# Altium schematic sheet STM321.SchDoc
size A4
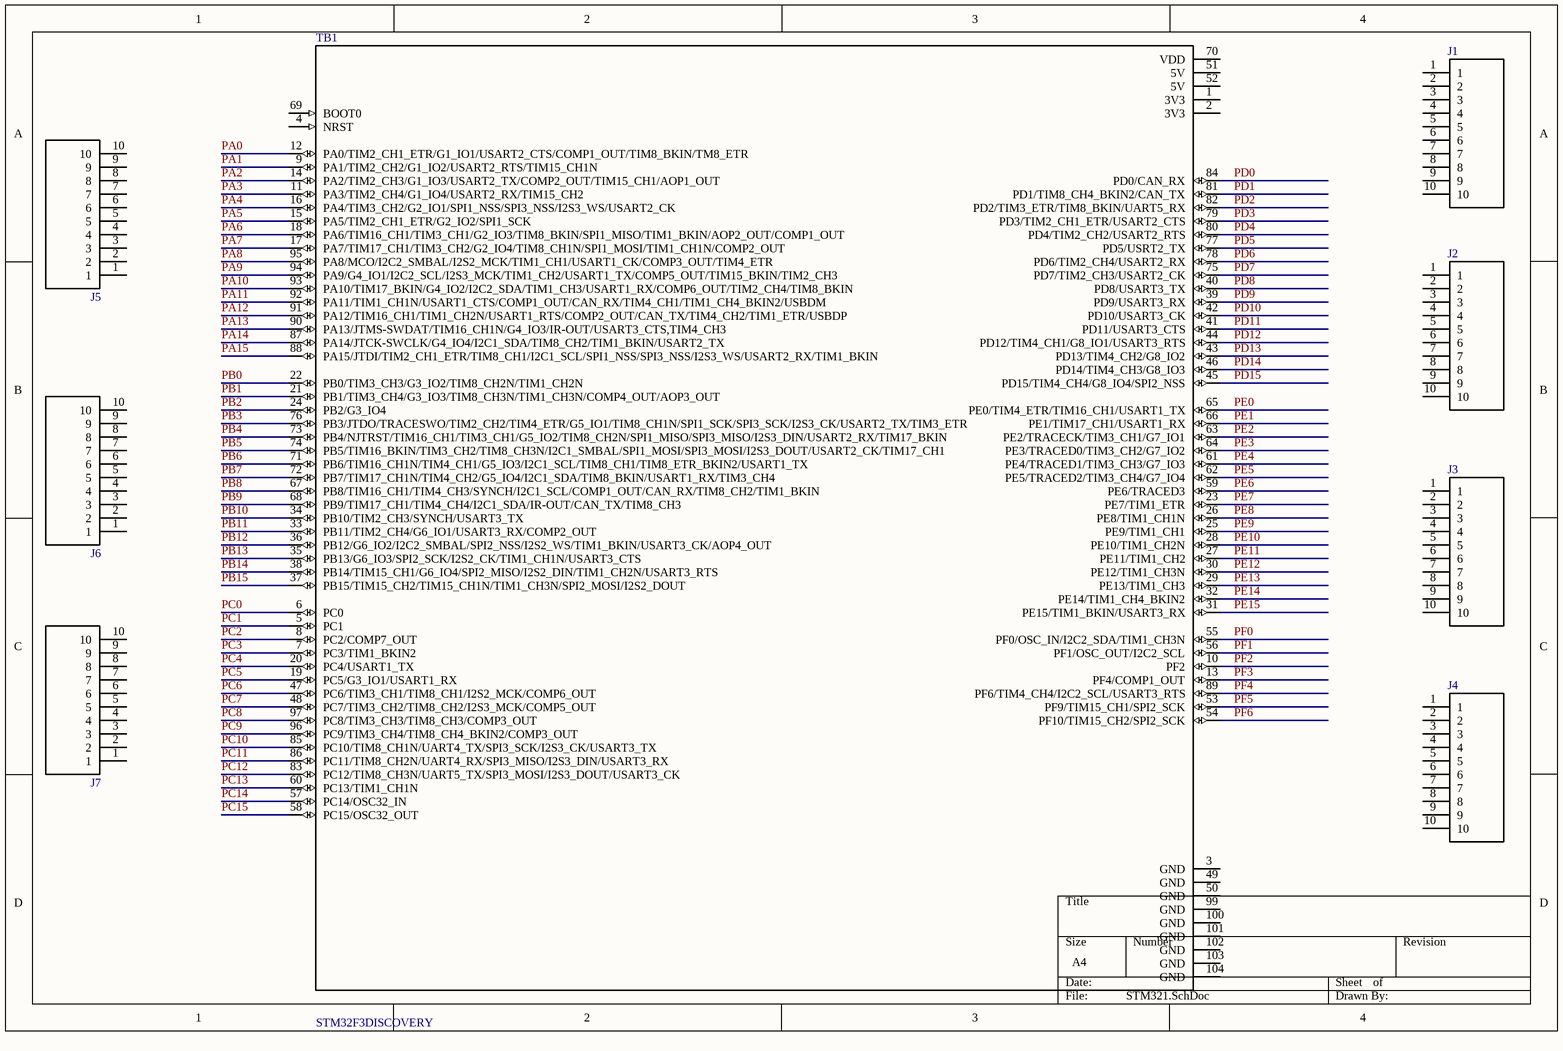
[diagram p0: STM321.SchDoc]

## Parts
J1  2-1761603-3  [*TE_2-1761603-3]  (value not drawn)
J2  2-1761603-3  [*TE_2-1761603-3]  (value not drawn)
J3  2-1761603-3  [*TE_2-1761603-3]  (value not drawn)
J4  2-1761603-3  [*TE_2-1761603-3]  (value not drawn)
J5  2-1761603-3  [*TE_2-1761603-3]  (value not drawn)
J6  2-1761603-3  [*TE_2-1761603-3]  (value not drawn)
J7  2-1761603-3  [*TE_2-1761603-3]  (value not drawn)
TB1  STM32F3DISCOVERY  [*SHIELD_STM32F3DISCOVERY]

## Nets
PA0: TB1.12(PA0/TIM2_CH1_ETR/G1_IO1/USART2_CTS/COMP1_OUT/TIM8_BKIN/TM8_ETR)
PA1: TB1.9(PA1/TIM2_CH2/G1_IO2/USART2_RTS/TIM15_CH1N)
PA2: TB1.14(PA2/TIM2_CH3/G1_IO3/USART2_TX/COMP2_OUT/TIM15_CH1/AOP1_OUT)
PA3: TB1.11(PA3/TIM2_CH4/G1_IO4/USART2_RX/TIM15_CH2)
PA4: TB1.16(PA4/TIM3_CH2/G2_IO1/SPI1_NSS/SPI3_NSS/I2S3_WS/USART2_CK)
PA5: TB1.15(PA5/TIM2_CH1_ETR/G2_IO2/SPI1_SCK)
PA6: TB1.18(PA6/TIM16_CH1/TIM3_CH1/G2_IO3/TIM8_BKIN/SPI1_MISO/TIM1_BKIN/AOP2_OUT/COMP1_OUT)
PA7: TB1.17(PA7/TIM17_CH1/TIM3_CH2/G2_IO4/TIM8_CH1N/SPI1_MOSI/TIM1_CH1N/COMP2_OUT)
PA8: TB1.95(PA8/MCO/I2C2_SMBAL/I2S2_MCK/TIM1_CH1/USART1_CK/COMP3_OUT/TIM4_ETR)
PA9: TB1.94(PA9/G4_IO1/I2C2_SCL/I2S3_MCK/TIM1_CH2/USART1_TX/COMP5_OUT/TIM15_BKIN/TIM2_CH3)
PA10: TB1.93(PA10/TIM17_BKIN/G4_IO2/I2C2_SDA/TIM1_CH3/USART1_RX/COMP6_OUT/TIM2_CH4/TIM8_BKIN)
PA11: TB1.92(PA11/TIM1_CH1N/USART1_CTS/COMP1_OUT/CAN_RX/TIM4_CH1/TIM1_CH4_BKIN2/USBDM)
PA12: TB1.91(PA12/TIM16_CH1/TIM1_CH2N/USART1_RTS/COMP2_OUT/CAN_TX/TIM4_CH2/TIM1_ETR/USBDP)
PA13: TB1.90(PA13/JTMS-SWDAT/TIM16_CH1N/G4_IO3/IR-OUT/USART3_CTS,TIM4_CH3)
PA14: TB1.87(PA14/JTCK-SWCLK/G4_IO4/I2C1_SDA/TIM8_CH2/TIM1_BKIN/USART2_TX)
PA15: TB1.88(PA15/JTDI/TIM2_CH1_ETR/TIM8_CH1/I2C1_SCL/SPI1_NSS/SPI3_NSS/I2S3_WS/USART2_RX/TIM1_BKIN)
PB0: TB1.22(PB0/TIM3_CH3/G3_IO2/TIM8_CH2N/TIM1_CH2N)
PB1: TB1.21(PB1/TIM3_CH4/G3_IO3/TIM8_CH3N/TIM1_CH3N/COMP4_OUT/AOP3_OUT)
PB2: TB1.24(PB2/G3_IO4)
PB3: TB1.76(PB3/JTDO/TRACESWO/TIM2_CH2/TIM4_ETR/G5_IO1/TIM8_CH1N/SPI1_SCK/SPI3_SCK/I2S3_CK/USART2_TX/TIM3_ETR)
PB4: TB1.73(PB4/NJTRST/TIM16_CH1/TIM3_CH1/G5_IO2/TIM8_CH2N/SPI1_MISO/SPI3_MISO/I2S3_DIN/USART2_RX/TIM17_BKIN)
PB5: TB1.74(PB5/TIM16_BKIN/TIM3_CH2/TIM8_CH3N/I2C1_SMBAL/SPI1_MOSI/SPI3_MOSI/I2S3_DOUT/USART2_CK/TIM17_CH1)
PB6: TB1.71(PB6/TIM16_CH1N/TIM4_CH1/G5_IO3/I2C1_SCL/TIM8_CH1/TIM8_ETR_BKIN2/USART1_TX)
PB7: TB1.72(PB7/TIM17_CH1N/TIM4_CH2/G5_IO4/I2C1_SDA/TIM8_BKIN/USART1_RX/TIM3_CH4)
PB8: TB1.67(PB8/TIM16_CH1/TIM4_CH3/SYNCH/I2C1_SCL/COMP1_OUT/CAN_RX/TIM8_CH2/TIM1_BKIN)
PB9: TB1.68(PB9/TIM17_CH1/TIM4_CH4/I2C1_SDA/IR-OUT/CAN_TX/TIM8_CH3)
PB10: TB1.34(PB10/TIM2_CH3/SYNCH/USART3_TX)
PB11: TB1.33(PB11/TIM2_CH4/G6_IO1/USART3_RX/COMP2_OUT)
PB12: TB1.36(PB12/G6_IO2/I2C2_SMBAL/SPI2_NSS/I2S2_WS/TIM1_BKIN/USART3_CK/AOP4_OUT)
PB13: TB1.35(PB13/G6_IO3/SPI2_SCK/I2S2_CK/TIM1_CH1N/USART3_CTS)
PB14: TB1.38(PB14/TIM15_CH1/G6_IO4/SPI2_MISO/I2S2_DIN/TIM1_CH2N/USART3_RTS)
PB15: TB1.37(PB15/TIM15_CH2/TIM15_CH1N/TIM1_CH3N/SPI2_MOSI/I2S2_DOUT)
PC0: TB1.6(PC0)
PC1: TB1.5(PC1)
PC2: TB1.8(PC2/COMP7_OUT)
PC3: TB1.7(PC3/TIM1_BKIN2)
PC4: TB1.20(PC4/USART1_TX)
PC5: TB1.19(PC5/G3_IO1/USART1_RX)
PC6: TB1.47(PC6/TIM3_CH1/TIM8_CH1/I2S2_MCK/COMP6_OUT)
PC7: TB1.48(PC7/TIM3_CH2/TIM8_CH2/I2S3_MCK/COMP5_OUT)
PC8: TB1.97(PC8/TIM3_CH3/TIM8_CH3/COMP3_OUT)
PC9: TB1.96(PC9/TIM3_CH4/TIM8_CH4_BKIN2/COMP3_OUT)
PC10: TB1.85(PC10/TIM8_CH1N/UART4_TX/SPI3_SCK/I2S3_CK/USART3_TX)
PC11: TB1.86(PC11/TIM8_CH2N/UART4_RX/SPI3_MISO/I2S3_DIN/USART3_RX)
PC12: TB1.83(PC12/TIM8_CH3N/UART5_TX/SPI3_MOSI/I2S3_DOUT/USART3_CK)
PC13: TB1.60(PC13/TIM1_CH1N)
PC14: TB1.57(PC14/OSC32_IN)
PC15: TB1.58(PC15/OSC32_OUT)
PD0: TB1.84(PD0/CAN_RX)
PD1: TB1.81(PD1/TIM8_CH4_BKIN2/CAN_TX)
PD2: TB1.82(PD2/TIM3_ETR/TIM8_BKIN/UART5_RX)
PD3: TB1.79(PD3/TIM2_CH1_ETR/USART2_CTS)
PD4: TB1.80(PD4/TIM2_CH2/USART2_RTS)
PD5: TB1.77(PD5/USRT2_TX)
PD6: TB1.78(PD6/TIM2_CH4/USART2_RX)
PD7: TB1.75(PD7/TIM2_CH3/USART2_CK)
PD8: TB1.40(PD8/USART3_TX)
PD9: TB1.39(PD9/USART3_RX)
PD10: TB1.42(PD10/USART3_CK)
PD11: TB1.41(PD11/USART3_CTS)
PD12: TB1.44(PD12/TIM4_CH1/G8_IO1/USART3_RTS)
PD13: TB1.43(PD13/TIM4_CH2/G8_IO2)
PD14: TB1.46(PD14/TIM4_CH3/G8_IO3)
PD15: TB1.45(PD15/TIM4_CH4/G8_IO4/SPI2_NSS)
PE0: TB1.65(PE0/TIM4_ETR/TIM16_CH1/USART1_TX)
PE1: TB1.66(PE1/TIM17_CH1/USART1_RX)
PE2: TB1.63(PE2/TRACECK/TIM3_CH1/G7_IO1)
PE3: TB1.64(PE3/TRACED0/TIM3_CH2/G7_IO2)
PE4: TB1.61(PE4/TRACED1/TIM3_CH3/G7_IO3)
PE5: TB1.62(PE5/TRACED2/TIM3_CH4/G7_IO4)
PE6: TB1.59(PE6/TRACED3)
PE7: TB1.23(PE7/TIM1_ETR)
PE8: TB1.26(PE8/TIM1_CH1N)
PE9: TB1.25(PE9/TIM1_CH1)
PE10: TB1.28(PE10/TIM1_CH2N)
PE11: TB1.27(PE11/TIM1_CH2)
PE12: TB1.30(PE12/TIM1_CH3N)
PE13: TB1.29(PE13/TIM1_CH3)
PE14: TB1.32(PE14/TIM1_CH4_BKIN2)
PE15: TB1.31(PE15/TIM1_BKIN/USART3_RX)
PF0: TB1.55(PF0/OSC_IN/I2C2_SDA/TIM1_CH3N)
PF1: TB1.56(PF1/OSC_OUT/I2C2_SCL)
PF2: TB1.10(PF2)
PF3: TB1.13(PF4/COMP1_OUT)
PF4: TB1.89(PF6/TIM4_CH4/I2C2_SCL/USART3_RTS)
PF5: TB1.53(PF9/TIM15_CH1/SPI2_SCK)
PF6: TB1.54(PF10/TIM15_CH2/SPI2_SCK)

Not connected (* = marked no-connect by the designer): J1 1 2 3 4 5 6 7 8 9 10; J2 1 2 3 4 5 6 7 8 9 10; J3 1 2 3 4 5 6 7 8 9 10; J4 1 2 3 4 5 6 7 8 9 10; J5 1 2 3 4 5 6 7 8 9 10; J6 1 2 3 4 5 6 7 8 9 10; J7 1 2 3 4 5 6 7 8 9 10; TB1 1(3V3) 2(3V3) 3(GND) 4(NRST) 49(GND) 50(GND) 51(5V) 52(5V) 69(BOOT0) 70(VDD) 99(GND) 100(GND) 101(GND) 102(GND) 103(GND) 104(GND)

## Library data of the parts
J1-J7 = 2-1761603-3: Header, Pin, Idc, Amp-Latch, 10 Pos, Low Profile, Pcb, Vertical, Blue; Number_of_Positions: 10; MF: TE Connectivity; Product_Type: Connector; Centerline_Pitch: 2.54 mm[.1 in]; Price: None; Package: None; TE_purchase_URL: https://www.te.com/usa-en/product-2-1761603-3.html?te_bu=Cor&te_type=disp&te_campaign=seda_glo_cor-seda-global-disp-prtnr-fy19-seda-model-bom-cta_sma-317_1&elqCampaignId=32493; Availability: Unavailable; SnapEDA_Link: https://www.snapeda.com/parts/2-1761603-3/TE%20Connectivity%20AMP%20Connectors/view-part/491411/?ref=snap; EU_RoHS_Compliance: Compliant; MP: 2-1761603-3; Value: *
TB1 = STM32F3DISCOVERY: STM32F303VCT6 Discovery STM32F3 ARMÂ® CortexÂ®-M4 MCU 32-Bit Embedded Evaluation Board; MF: STMicroelectronics; Availability: Unavailable; SnapEDA_Link: https://www.snapeda.com/parts/STM32F3DISCOVERY/STMicroelectronics/view-part/10815/?ref=snap; Price: None; Package: LQFP-100 STMicroelectronics; MP: STM32F3DISCOVERY; Value: *